# Altium schematic sheet Power Distribution - Power Supply.SchDoc: Title
size B; Organization: Midnight Sun Solar Rayce Car Team; Address1: University of Waterloo; Address2: 200 University Ave W; Address3: Waterloo, ON, Canada; Address4: N2L 3E9; Website: www.uwmidsun.com; ProjectName: ProjectName
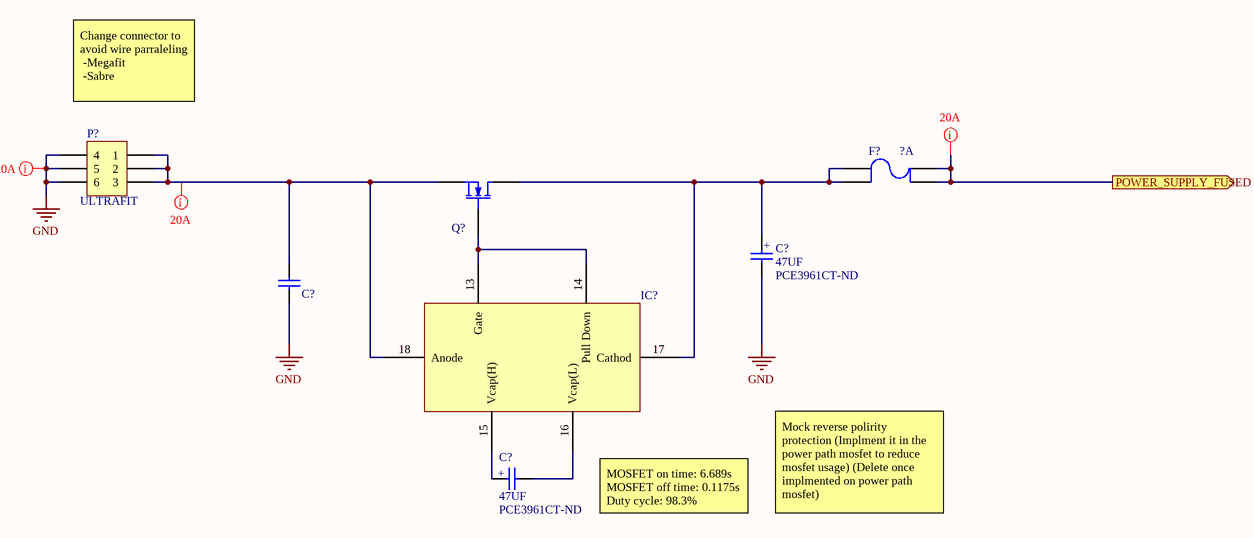
[diagram p0: Power Distribution - Power Supply.SchDoc]

## Parts
(Parts that share a designator on the sheet are numbered #1, #2 ... from top to bottom, then left to right.)
C?#1  47UF  Supplier Part Number 1: PCE3961CT-ND  [CAP ALUM 6.3MM RADIAL SMD]
C?#2  CAP CER 100PF 50V C0G/NP0 0603  [CAP, 0603]  (value not drawn)
C?#3  47UF  Supplier Part Number 1: PCE3961CT-ND  [CAP ALUM 6.3MM RADIAL SMD]
F?  ?A  [FUSE ATO/ATC FUSE HOLDER]
IC?  IC SMART DIODE CTLR 8VSSOP  (value not drawn)
P?  Series: ULTRAFIT  [CONN, 6POS ULTRA-FIT]  (hidden comment: CONN 6POS ULTRA-FIT 0.138")
Q?  MOSFET N-CH 60V 4A 3.3W SOT-223  [N-CH MOSFET SOT-23]  (value not drawn)

## Ports
POWER_SUPPLY_FUSED (out)

## Nets
GND: C?#1.2 C?#2.2 P?.4 P?.5 P?.6
POWER_SUPPLY_FUSED: F?.2 F?.4 ; port POWER_SUPPLY_FUSED
NetC?#1_1: C?#1.1 F?.1 F?.3 IC?.17(Cathod) Q?.3(D)
NetC?#2_1: C?#2.1 IC?.18(Anode) P?.1 P?.2 P?.3 Q?.2(S)
NetC?#3_1: C?#3.1 IC?.15(Vcap(H))
NetC?#3_2: C?#3.2 IC?.16(Vcap(L))
NetIC?_13: IC?.13(Gate) IC?.14(Pull_Down) Q?.1(G)

## Layout directives
net class HighCurrent; rule Power Plane Connect Style [Style - Direct Connect]; rule Polygon Connect Style [Style - Direct Connect]: GND, NetC?#2_1, POWER_SUPPLY_FUSED

## Notes on the sheet
- Change connector to avoid wire parraleling
  -Megafit
  -Sabre
- (near IC?) MOSFET on time: 6.689s
  MOSFET off time: 0.1175s
  Duty cycle: 98.3%
- Mock reverse polirity protection (Implment it in the power path mosfet to reduce mosfet usage) (Delete once implmented on power path mosfet)
- PROJECT
- DOCUMENT
- DRAWN BY
- LAST MODIFIED
- PART NUMBER
- REVISION
- SHEET
- VARIANT
- OF
- Engineering 5 - 1002
  University of Waterloo
  (519) 888-4567 x32978
  hardware@uwmidsun.com
- (in symbol CAP ALUM 47UF 20% 35V SMD) +

## Library data of the parts
C?#1 C?#3 = CAP ALUM 47UF 20% 35V SMD: 47µF 35V Aluminum Electrolytic Capacitors Radial, Can - SMD 1000 Hrs @ 85°C; Manufacturer: Panasonic; Manufacturer Part Number: EEE-1VA470WP; Tolerance: 20%; Ripple Current: 70mA; Life (Hours): 1000Hour; Supplier 1: Digi-Key; Stock 1: 2820; Pricing 1: 1=0.38, 10=0.263, 100=0.1579, 500=0.11846 (USD); Mount: Surface Mount,PCB; Case/Package: Radial; Contact Plating: Tin; Min Operating Temperature: -40°C; Max Operating Temperature: 85°C; Capacitance: 47uF; Voltage Rating (DC): 35V; Voltage Rating: 35V; Packaging: Tape and Reel; Package Quantity: 1; Ripple Current (AC): 70mA; Termination: SMD/SMT; Diameter: 6.3mm; Length: 5.5mm; Height: 5.4mm; Height - Seated (Max): 0.213inch; Radiation Hardening: No; REACH SVHC: Unknown; Lead Free: Lead Free; ComponentLink1URL: https://datasheet.ciiva.com/2983/aba0000ce2-2983926.pdf; ComponentLink1Description: https://datasheet.ciiva.com/2983/aba0000ce2-2983926.pdf; ComponentLink2URL: https://datasheet.ciiva.com/2983/aba0000ce2-2983927.pdf; ComponentLink2Description: https://datasheet.ciiva.com/2983/aba0000ce2-2983927.pdf; ComponentLink3URL: https://datasheet.ciiva.com/14598/70255710-14598937.pdf; ComponentLink3Description: https://datasheet.ciiva.com/14598/70255710-14598937.pdf; ComponentLink4URL: https://datasheet.ciiva.com/15165/getdatasheetpartid-86239-15165868.pdf; ComponentLink4Description: https://datasheet.ciiva.com/15165/getdatasheetpartid-86239-15165868.pdf; ComponentLink5URL: https://datasheet.ciiva.com/16507/aba0000ce2-16507965.pdf; ComponentLink5Description: https://datasheet.ciiva.com/16507/aba0000ce2-16507965.pdf; ComponentLink6URL: https://datasheet.ciiva.com/30206/11aba0000ce2-30206253.pdf; ComponentLink6Description: https://datasheet.ciiva.com/30206/11aba0000ce2-30206253.pdf
C?#2 = CAP CER 100PF 50V C0G/NP0 0603: 100pF ±1% 50V Ceramic Capacitor C0G, NP0 0603 (1608 Metric); Manufacturer: Kyocera AVX; Manufacturer Part Number: 06035A101FAT2A; Supplier 1: Digi-Key; Stock 1: 176069; Pricing 1: 1=0.24, 10=0.161, 100=0.0814, 500=0.0557, 1000=0.0493 (USD); Mount: Surface Mount; Case/Package: 0603; Case Code (Imperial): 0603; Case Code (Metric): 1608; Min Operating Temperature: -55°C; Max Operating Temperature: 125°C; Capacitance: 100pF; Tolerance: 1%; Packaging: Tape and Reel; Voltage Rating: 50V; Package Quantity: 1; Voltage Rating (DC): 50V; Dielectric: C0G; Termination: SMD/SMT; Voltage: 50V; Length: 1.6mm; Height: 0.86mm; Width: 0.81mm; Thickness: 0.035inch; Depth: 0.81mm; Radiation Hardening: No; REACH SVHC: No SVHC; Lead Free: Lead Free; ComponentLink1URL: https://datasheet.ciiva.com/22682/1796416-22682854.pdf; ComponentLink1Description: https://datasheet.ciiva.com/22682/1796416-22682854.pdf; ComponentLink2URL: https://datasheet.ciiva.com/150/ccog-150746.pdf; ComponentLink2Description: https://datasheet.ciiva.com/150/ccog-150746.pdf; ComponentLink3URL: https://datasheet.ciiva.com/150/ccog-150747.pdf; ComponentLink3Description: https://datasheet.ciiva.com/150/ccog-150747.pdf; ComponentLink4URL: https://datasheet.ciiva.com/150/ccog-150748.pdf; ComponentLink4Description: https://datasheet.ciiva.com/150/ccog-150748.pdf; ComponentLink5URL: https://datasheet.ciiva.com/28585/1796416-28585980.pdf; ComponentLink5Description: https://datasheet.ciiva.com/28585/1796416-28585980.pdf; ComponentLink6URL: https://datasheet.ciiva.com/16300/ccog-16300413.pdf; ComponentLink6Description: https://datasheet.ciiva.com/16300/ccog-16300413.pdf; ComponentLink7URL: https://datasheet.ciiva.com/17492/ccog-17492189.pdf; ComponentLink7Description: https://datasheet.ciiva.com/17492/ccog-17492189.pdf; Supplier Part Number 1: 478-6202-1-ND
F? = FUSE ATO FUSE HOLDER: Fuse Block 30A 500V 1 Circuit Blade PCB; Manufacturer 1: Keystone Electronics; Manufacturer Part Number 1: 3557-2; Description 1: FUSE BLOCK BLADE 500V 30A PCB; For Use With/Related Products: ATC, ATO 257, MINI 897; Fuse Size: 0.43" L x 0.15" W x 0.64" H (10.92mm x 3.81mm x 16.25mm); Number of Circuits: 1; Supplier 1: Digi-Key; Supplier Part Number 1: 36-3557-2-ND; RoHS: RoHS Compliant; Category: Circuit Protection; Stock 1: 48838; Pricing 1: 1=1.66, 10=1.442, 50=1.3008, 100=1.2441, 250=1.13096, 500=1.01784, 1000=1.0126, 2500=0.84861, 5000=0.81519 (CAD); Part Status: Active; Fuseholder Type: Block; Fuse Type: Blade; Voltage: 500V; Current Rating: 30A; Mounting Type: PCB; Orientation: Vertical; Termination Style: PC Pin; Contact Material: Brass; Contact Finish: Tin Nickel; ComponentLink1URL: http://www.keyelco.com/product-pdf.cfm?p=296; ComponentLink1Description: http://www.keyelco.com/product-pdf.cfm?p=296
IC? = IC SMART DIODE CTLR 8VSSOP: OR Controller N+1 ORing Controller N-Channel N:1 8-VSSOP; Manufacturer: Texas Instruments; Internal Switch(s): No; Voltage - Supply: 42V (Max); Series: Automotive, AEC-Q100; Type: N+1 ORing Controller; Part Status: Active; FET Type: N-Channel; Ratio - Input:Output: N:1; Current - Output (Max): -; Operating Temperature: -40°C ~ 125°C; Applications: General Purpose; Package / Case: 8-TSSOP, 8-MSOP (0.118", 3.00mm Width); Supplier Device Package: 8-VSSOP; Mounting Type: Surface Mount; Supplier 1: Digi-Key; ComponentLink1Description: http://www.ti.com/lit/ds/symlink/lm74610-q1.pdf; ComponentLink1URL: http://www.ti.com/lit/ds/symlink/lm74610-q1.pdf; Supplier Part Number 1: 296-43067-1-ND
P? = CONN 6POS ULTRA-FIT 0.138": 6 Positions Header Connector 0.138" (3.50mm) Through Hole Tin; Manufacturer 1: Molex, LLC; Manufacturer Part Number 1: 1722991106; Style: Board to Cable/Wire; Shrouding: Shrouded - 4 Wall; Number of Positions: 6; Number of Positions Loaded: All; Row Spacing - Mating: 0.181" (4.60mm); Contact Length - Post: 0.126" (3.20mm); Material Flammability Rating: UL94 V-0; Mated Stacking Heights: 26.99mm; Voltage: 400V; Supplier 1: Digi-Key; Supplier Part Number 1: WM11778-ND; Packaging: Tray; Part Status: Active; Connector Type: Header; Contact Type: Male Pin; Pitch - Mating: 0.138" (3.50mm); Number of Rows: 2; Mounting Type: Through Hole; Termination: Solder; Fastening Type: Latch Holder; Contact Length - Mating: -; Overall Contact Length: -; Insulation Height: 0.465" (11.80mm); Contact Shape: Square; Contact Finish - Mating: Tin; Contact Finish Thickness - Mating: 60µin (1.52µm); Contact Finish - Post: Tin; Contact Material: Copper Alloy; Insulation Material: Liquid Crystal Polymer (LCP); Operating Temperature: -40°C ~ 105°C; Ingress Protection: -; Insulation Color: Black; Current Rating: -; Contact Finish Thickness - Post: 60µin (1.52µm); ComponentLink1URL: http://www.molex.com/pdm_docs/sd/1722991106_sd.pdf; ComponentLink1Description: http://www.molex.com/pdm_docs/sd/1722991106_sd.pdf
Q? = MOSFET N-CH 60V 4A 3.3W SOT-223: N-Channel 60V 4A (Tc) 3.3W (Tc) Surface Mount SOT-223; Manufacturer 1: STMicroelectronics; Manufacturer Part Number 1: STN3NF06L; Current - Continuous Drain (Id) @ 25°C: 4A (Tc); Drive Voltage (Max Rds On,  Min Rds On): 5V, 10V; Vgs(th) (Max) @ Id: 2.8V @ 250µA; Gate Charge (Qg) (Max) @ Vgs: 9nC @ 5V; Input Capacitance (Ciss) (Max) @ Vds: 340pF @ 25V; Vgs (Max): ±16V; Rds On (Max) @ Id, Vgs: 100 mOhm @ 1.5A, 10V; Supplier 1: Digi-Key; Supplier Part Number 1: 497-3177-1-ND; Packaging: Cut Tape (CT); Part Status: Active; FET Type: N-Channel; Technology: MOSFET (Metal Oxide); Drain to Source Voltage (Vdss): 60V; FET Feature: -; Power Dissipation (Max): 3.3W (Tc); Operating Temperature: -55°C ~ 150°C (TJ); Mounting Type: Surface Mount; Supplier Device Package: SOT-223; Package / Case: TO-261-4, TO-261AA; ComponentLink1URL: http://www.st.com/content/ccc/resource/technical/document/datasheet/b1/52/93/f0/a9/a9/40/d7/CD00002430.pdf/files/CD00002430.pdf/jcr:content/translations/en.CD00002430.pdf; ComponentLink1Description: http://www.st.com/content/ccc/resource/technical/document/datasheet/b1/52/93/f0/a9/a9/40/d7/CD00002430.pdf/files/CD00002430.pdf/jcr:content/translations/en.CD00002430.pdf